# EAGLE design UartSBee v5.0 (EAGLE 6.4)
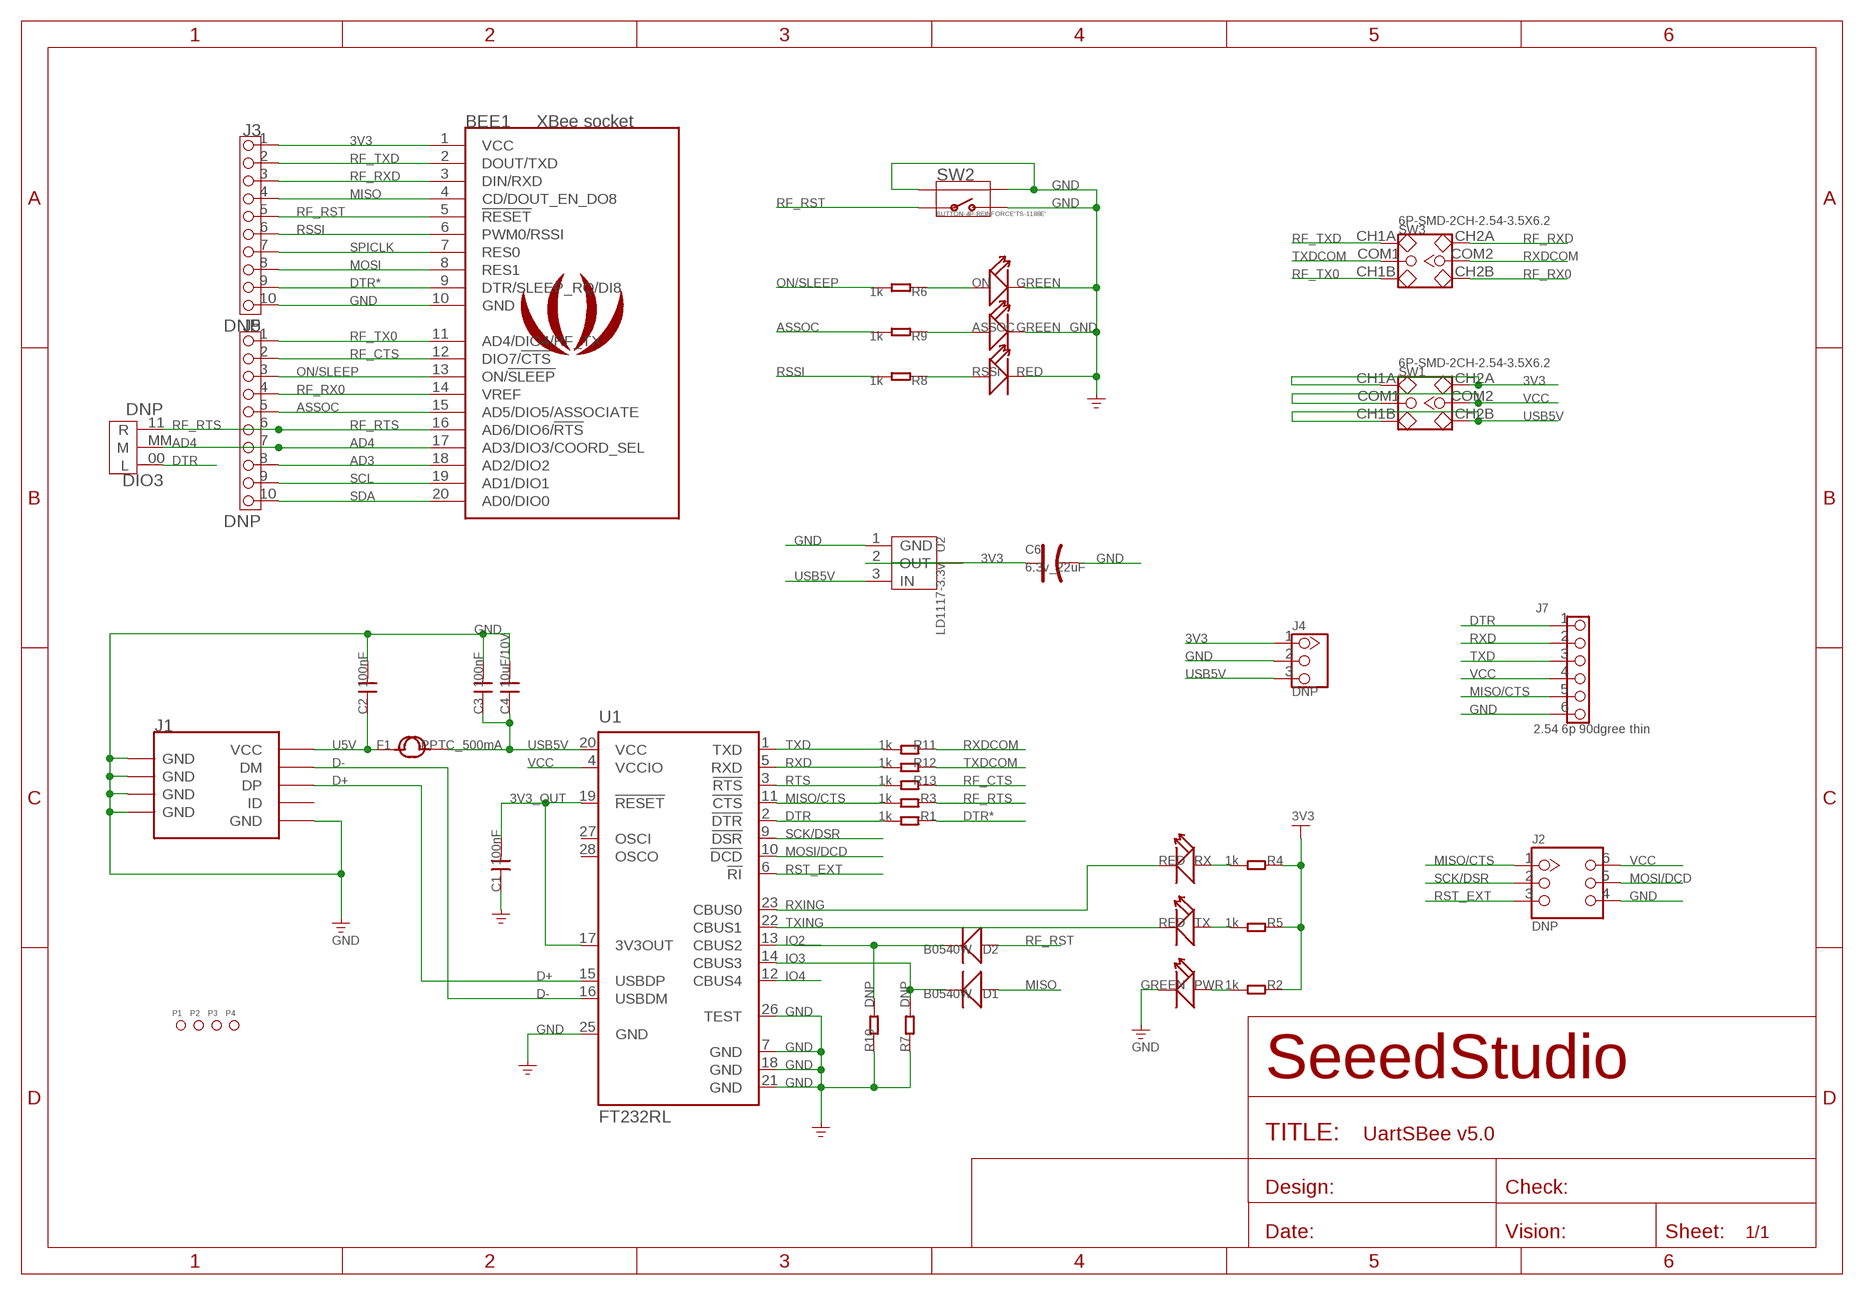
[diagram p0: schematic, sheet 1]

## Parts
ASSOC  GREEN  LED-0603  [D0603]
BEE1  XBee socket  BEE_BLANK  [BEE_BLANK]
C1  100nF  C-0603  [0603]
C2  100nF  C-0603  [0603]
C3  100nF  C-0603  [0603]
C4  10uF/10V  C-0805  [0805]
C6  6.3v_22uF  CAP_AVX_A  [AVX-A]
D1  B0540W  D'MBR0520LT1'  [SOD123-2.7X1.6]
D2  B0540W  D'MBR0520LT1'  [SOD123-2.7X1.6]
DIO3  DNP  PAD-JUMPER-3P-40*40  [3P-SMD-4.1X1.5]
F1  PPTC_500mA  FUSE'1206'  [F1206]
J1  USB-MINIUSB-5P-MICRO  [MICRO-USB]
J2  DNP  CK_2X3_DD  [CK_2X3]
J3  DNP  HEADER-10P-2.54  [10P-2.54-LEADED]
J4  DNP  HEADER-3P-2.54  [3P-2.54-LEADED]
J5  DNP  HEADER-10P-2.54  [10P-2.54-LEADED]
J7  2.54 6p 90dgree thin  HEADER-6P-LEADED-2.54  [6P-2.54-LEADED]
LOGO1  LOGO_COPPER150X124  [LOGO_COPPER_150X124]
ON  GREEN  LED-0603  [D0603]
P1  PAD-MARK  [ROUND-MARK-1.0]
P2  PAD-MARK  [ROUND-MARK-1.0]
P3  PAD-MARK  [ROUND-MARK-1.0]
P4  PAD-MARK  [ROUND-MARK-1.0]
PWR  GREEN  LED-0603  [D0603]
R1  1k  R-0603  [R0603]
R2  1k  R-0603  [R0603]
R3  1k  R-0603  [R0603]
R4  1k  R-0603  [R0603]
R5  1k  R-0603  [R0603]
R6  1k  R-0603  [R0603]
R7  DNP  R-0603  [R0603]
R8  1k  R-0603  [R0603]
R9  1k  R-0603  [R0603]
R10  DNP  R-0603  [R0603]
R11  1k  R-0603  [R0603]
R12  1k  R-0603  [R0603]
R13  1k  R-0603  [R0603]
RSSI  RED  LED-0603  [D0603]
RX  RED  LED-0603  [D0603]
SW1  6P-SMD-2CH-2.54-3.5X6.2  SWITCH-2CH-6P-SMD  [6P-SMD-2CH-2.54-3.5X6.2]
SW2  BUTTON-4P-REINFORCE'TS-1188E'  [4P-SMD-7X3.5X3.5H]
SW3  6P-SMD-2CH-2.54-3.5X6.2  SWITCH-2CH-6P-SMD  [6P-SMD-2CH-2.54-3.5X6.2]
TX  RED  LED-0603  [D0603]
U1  FT232RL  [SSOP28]
U2  LD1117-3.3v  LD1117SOT89  [SOT89]

## Nets
3V3: BEE1.1(VCC) C6.+ J3.1 J4.1 R2.1 R4.1 R5.1 SW1.CH1A SW1.CH2A U2.2(OUT) U2.4(TAB) ; supply symbol labelled POWER_BAR
3V3_OUT: C1.2 U1.17(3V3OUT) U1.19(!RESET)
AD3: BEE1.18(AD2/DIO2) J5.8
AD4: BEE1.17(AD3/DIO3/COORD_SEL) DIO3.MM(M) J5.7
ASSOC: BEE1.15(AD5/DIO5/ASSOCIATE) J5.5 R9.2
D+: J1.3(DP) U1.15(USBDP)
D-: J1.2(DM) U1.16(USBDM)
DTR: DIO3.00(L) J7.1 R1.2 U1.2(!DTR)
DTR*: BEE1.9(DTR/SLEEP_RQ/DI8) J3.9 R1.1
GND: ASSOC.- BEE1.10(GND) C1.1 C2.2 C3.2 C4.2 C6.- J1.5(GND) J1.S1(GND) J1.S2(GND) J1.S3(GND) J1.S4(GND) J1.S5(GND) J1.S6(GND) J2.4 J3.10 J4.2 J7.6 ON.- PWR.- R7.1 R10.1 RSSI.- SW2.2 SW2.S1 SW2.S2 U1.7(GND) U1.18(GND) U1.21(GND) U1.25(GND) U1.26(TEST) U2.1(GND)
IO2: D2.2(-) R10.2 U1.13(CBUS2)
IO3: D1.2(-) R7.2 U1.14(CBUS3)
IO4: U1.12(CBUS4)
MISO: BEE1.4(CD/DOUT_EN_DO8) D1.1(+) J3.4
MISO/CTS: J2.1 J7.5 R3.2 U1.11(!CTS)
MOSI: BEE1.8(RES1) J3.8
MOSI/DCD: J2.5 U1.10(!DCD)
N$1: R5.2 TX.+
N$2: R4.2 RX.+
N$3: PWR.+ R2.2
N$7: ON.+ R6.1
N$8: ASSOC.+ R9.1
N$11: R8.1 RSSI.+
ON/SLEEP: BEE1.13(ON/!SLEEP) J5.3 R6.2
RF_CTS: BEE1.12(DIO7/!CTS) J5.2 R13.1
RF_RST: BEE1.5(!RESET) D2.1(+) J3.5 SW2.1
RF_RTS: BEE1.16(AD6/DIO6/!RTS) DIO3.11(R) J5.6 R3.1
RF_RX0: BEE1.14(VREF) J5.4 SW3.CH2B
RF_RXD: BEE1.3(DIN/RXD) J3.3 SW3.CH2A
RF_TX0: BEE1.11(AD4/DIO4/RF_TX) J5.1 SW3.CH1B
RF_TXD: BEE1.2(DOUT/TXD) J3.2 SW3.CH1A
RSSI: BEE1.6(PWM0/RSSI) J3.6 R8.2
RST_EXT: J2.3 U1.6(!RI)
RTS: R13.2 U1.3(!RTS)
RXD: J7.2 R12.2 U1.5(RXD)
RXDCOM: R11.1 SW3.COM2
RXING: RX.- U1.23(CBUS0)
SCK/DSR: J2.2 U1.9(!DSR)
SCL: BEE1.19(AD1/DIO1) J5.9
SDA: BEE1.20(AD0/DIO0) J5.10
SPICLK: BEE1.7(RES0) J3.7
TXD: J7.3 R11.2 U1.1(TXD)
TXDCOM: R12.1 SW3.COM1
TXING: TX.- U1.22(CBUS1)
U5V: C2.1 F1.1 J1.1(VCC)
USB5V: C3.1 C4.1 F1.2 J4.3 SW1.CH1B SW1.CH2B U1.20(VCC) U2.3(IN)
VCC: J2.6 J7.4 SW1.COM1 SW1.COM2 U1.4(VCCIO)
Unconnected: J1.4(ID) U1.27(OSCI) U1.28(OSCO)

## Library data of the parts
ASSOC ON PWR RSSI RX TX = Discrete:LED*
BEE1 = EXT_moudle:BEE
C1-C4 = Discrete:C*: Ceramic Capacitors
C6 = Discrete:CAP*: Electrolytic Capacitors,Tantalum Capacitors and Super Capacitors
D1 D2 = Discrete:D*
DIO3 = Discrete:PAD-JUMPER-3P
F1 = Discrete:FUSE
J1 = Connector :USB-MINIUSB-5P
J2 = CONNECTER:CK_2X3
J3 J5 = Connector:HEADER-10P
J4 = Connector:HEADER-3P
J7 = Connector:HEADER-6P
LOGO1 = logo:LOGO_COPPER
P1-P4 = Discrete:PAD-MARK; PARTNO: DNP
R1-R13 = Discrete:R*
SW1 SW3 = Discrete:SWITCH-2CH-6P
SW2 = Discrete:BUTTON-4P-REINFORCE: TS-1188E http://www.best-dz.com/?thread-374-2.html
U1 = IC_SMD:FT232R: Source: http://www.ftdichip.com/Documents/DataSheets/DS_FT232R_v104.pdf
U2 = IC:LD1117

## Net classes
0 default: width 0.152 mm, drill 0.305 mm, clearance 0.152 mm

## Board
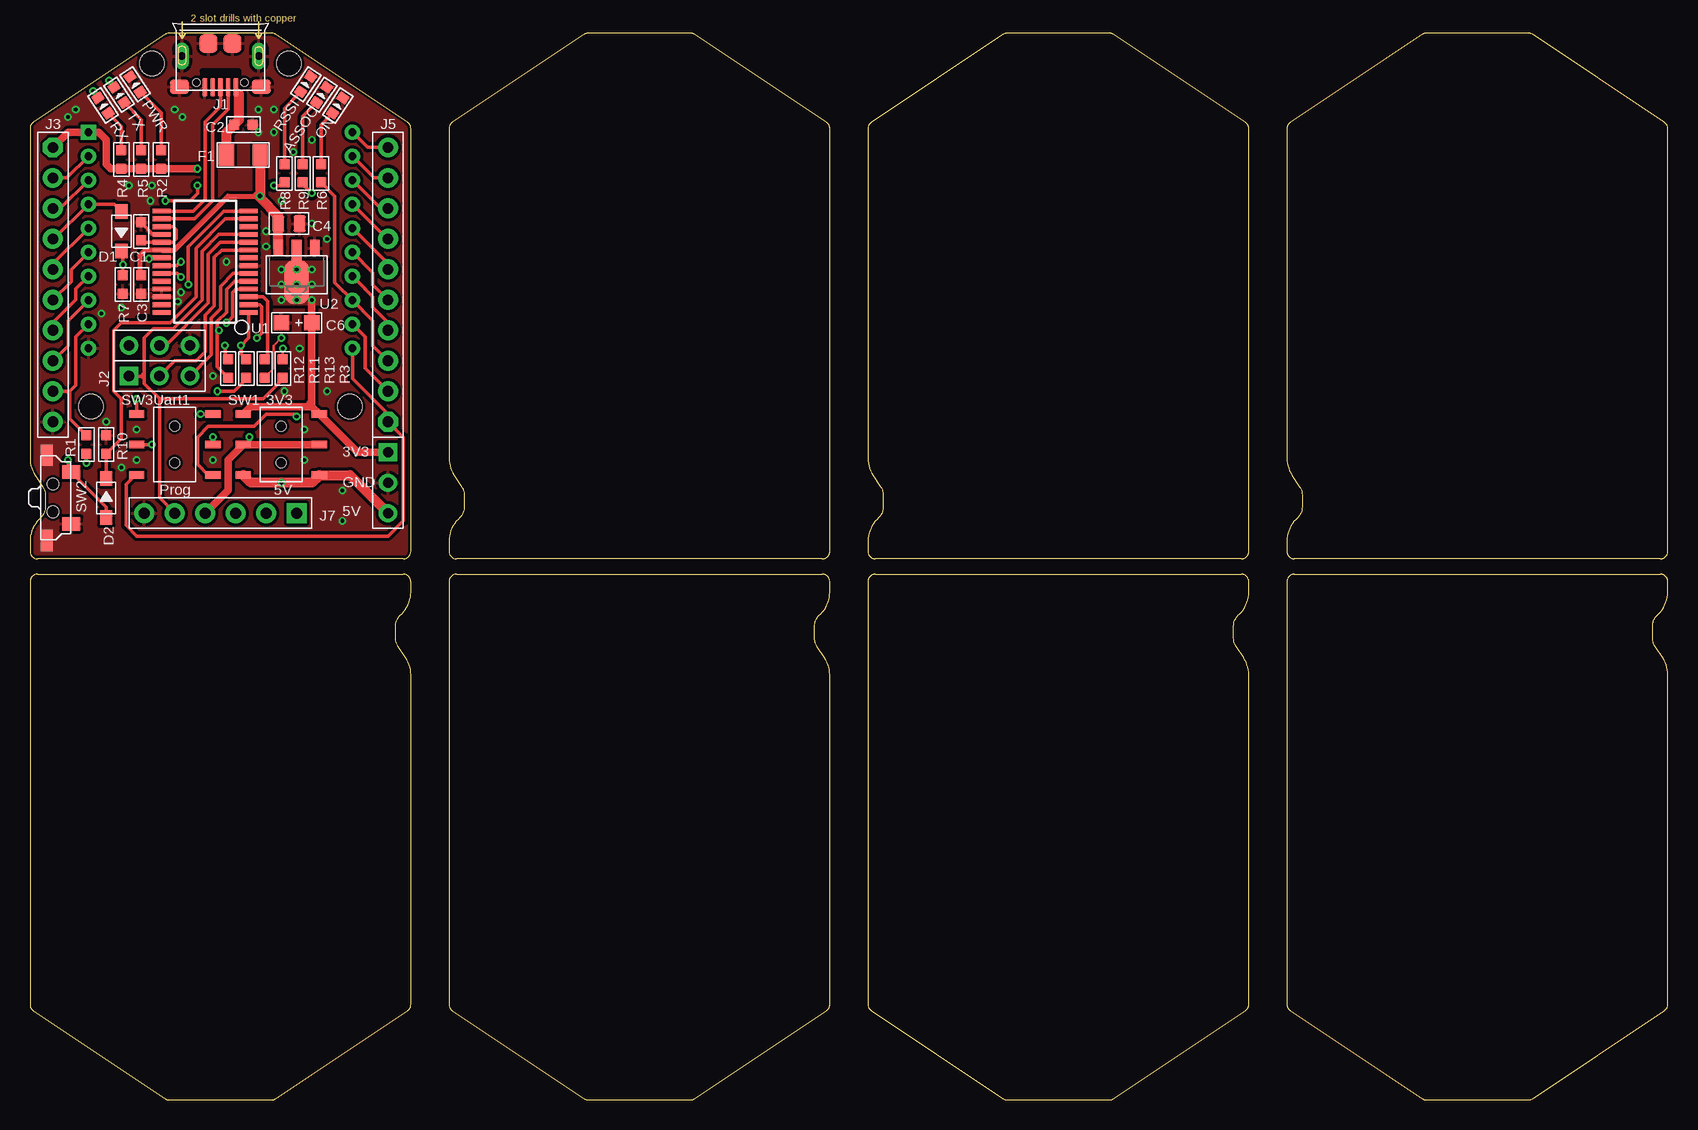
[diagram p1: board, top side]
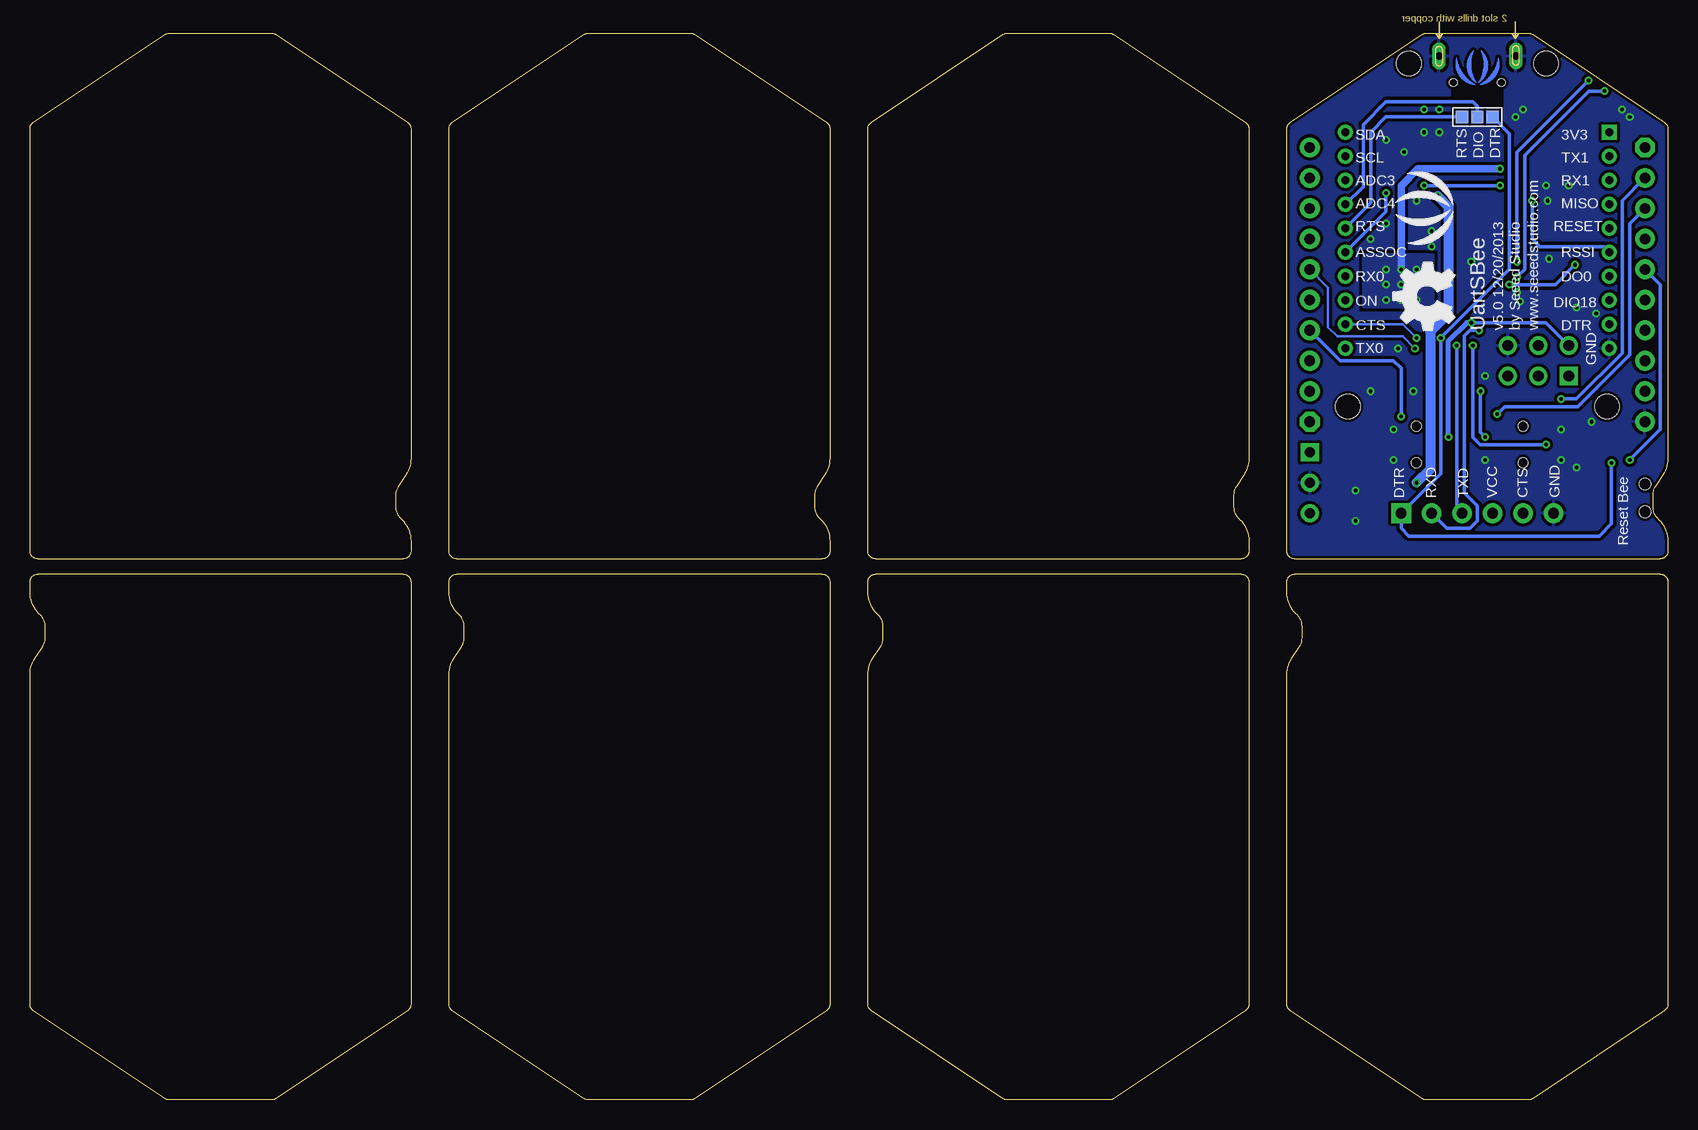
[diagram p2: board, bottom side, seen from below]

Size 136.53 x 88.9 mm. Coordinates in mm from the lower left corner, seen from the top.
Outline: 31.11,45.09 arc90 31.75,45.72 31.75,80.94 arc56 31.47,81.47 20.48,88.79 arc34 20.13,88.9 11.62,88.9 arc34 11.27,88.79 0.28,81.47 arc56 0,80.94 0,53.47 arc34 0.43,52.06 1.06,51.12 arc-34 1.27,50.41 1.27,49.42 arc-45 0.9,48.52 0.74,48.37 arc45 0,46.57 0,45.72 arc90 0.64,45.09 31.11,45.09
Outline: 0.64,43.81 arc90 0,43.18 0,7.96 arc56 0.28,7.43 11.27,0.11 arc34 11.62,0 20.13,0 arc34 20.48,0.11 31.47,7.43 arc56 31.75,7.96 31.75,35.43 arc34 31.32,36.84 30.69,37.78 arc-34 30.48,38.48 30.48,39.48 arc-45 30.85,40.38 31.01,40.53 arc45 31.75,42.33 31.75,43.18 arc90 31.11,43.81 0.64,43.81
Outline: 66.04,45.09 arc90 66.67,45.72 66.67,80.94 arc56 66.39,81.47 55.41,88.79 arc34 55.05,88.9 46.55,88.9 arc34 46.2,88.79 35.21,81.47 arc56 34.92,80.94 34.92,53.47 arc34 35.35,52.06 35.98,51.12 arc-34 36.2,50.41 36.2,49.42 arc-45 35.82,48.52 35.67,48.37 arc45 34.92,46.57 34.92,45.72 arc90 35.56,45.09 66.04,45.09
Outline: 35.56,43.81 arc90 34.92,43.18 34.92,7.96 arc56 35.21,7.43 46.2,0.11 arc34 46.55,0 55.05,0 arc34 55.41,0.11 66.39,7.43 arc56 66.67,7.96 66.67,35.43 arc34 66.25,36.84 65.62,37.78 arc-34 65.41,38.48 65.41,39.48 arc-45 65.78,40.38 65.93,40.53 arc45 66.67,42.33 66.67,43.18 arc90 66.04,43.81 35.56,43.81
Outline: 100.97,45.09 arc90 101.6,45.72 101.6,80.94 arc56 101.32,81.47 90.33,88.79 arc34 89.98,88.9 81.47,88.9 arc34 81.12,88.79 70.13,81.47 arc56 69.85,80.94 69.85,53.47 arc34 70.28,52.06 70.91,51.12 arc-34 71.12,50.41 71.12,49.42 arc-45 70.75,48.52 70.59,48.37 arc45 69.85,46.57 69.85,45.72 arc90 70.48,45.09 100.97,45.09
Outline: 70.48,43.81 arc90 69.85,43.18 69.85,7.96 arc56 70.13,7.43 81.12,0.11 arc34 81.47,0 89.98,0 arc34 90.33,0.11 101.32,7.43 arc56 101.6,7.96 101.6,35.43 arc34 101.17,36.84 100.54,37.78 arc-34 100.33,38.48 100.33,39.48 arc-45 100.7,40.38 100.86,40.53 arc45 101.6,42.33 101.6,43.18 arc90 100.97,43.81 70.48,43.81
Outline: 135.89,45.09 arc90 136.53,45.72 136.53,80.94 arc56 136.24,81.47 125.25,88.79 arc34 124.9,88.9 116.4,88.9 arc34 116.05,88.79 105.06,81.47 arc56 104.78,80.94 104.78,53.47 arc34 105.2,52.06 105.83,51.12 arc-34 106.05,50.41 106.05,49.42 arc-45 105.67,48.52 105.52,48.37 arc45 104.78,46.57 104.78,45.72 arc90 105.41,45.09 135.89,45.09
Outline: 105.41,43.81 arc90 104.78,43.18 104.78,7.96 arc56 105.06,7.43 116.05,0.11 arc34 116.4,0 124.9,0 arc34 125.25,0.11 136.24,7.43 arc56 136.53,7.96 136.53,35.43 arc34 136.1,36.84 135.47,37.78 arc-34 135.25,38.48 135.25,39.48 arc-45 135.63,40.38 135.78,40.53 arc45 136.53,42.33 136.53,43.18 arc90 135.89,43.81 105.41,43.81
Copper layers (1*16): Top 0.035mm / dielectric 1.5mm / Bottom 0.035mm
Design rules "SeeedStudio_DRU_no_angle_20130527 *": minimum track width 6mil, minimum drill 12mil, track to track 6mil, track to pad 6mil, pad to pad 6mil, via to via 6mil, smd to smd 0mil, copper to edge 10mil, drill to drill 10mil, minimum pad ring 10mil, minimum via ring 6mil, stop-mask expansion 2mil, vias tented up to drill 25mil, thermal gap 10mil
Holes 2.03 mm at 10.16,86.36 21.59,86.36 5.08,57.78 26.67,57.78
Holes 1.91 mm at -4.06,81.28 -4.06,8.89 140.59,8.89 140.59,81.28
tRestrict: area 9,64.2 to 10.4,65.2
bRestrict: area 14,81.9 to 17.8,85.1

### Footprints (pad centres in the part's own frame; a part is rotated, then mirrored left to right if it is on the bottom)
D0603 = smd 0.762 x 0.889: + -0.762,0; - 0.762,0
BEE_BLANK = drill 0.635 pad 1.27 square: 1 -11,0 | drill 0.635 pad 1.27: 2 -11,-2; 3 -11,-4; 4 -11,-6; 5 -11,-8; 6 -11,-10; 7 -11,-12; 8 -11,-14; 9 -11,-16; 10 -11,-18; 11 11,-18; 12 11,-16; 13 11,-14; 14 11,-12; 15 11,-10; 16 11,-8; 17 11,-6; 18 11,-4; 19 11,-2; 20 11,0
0603 = smd 0.889 x 0.889: 1 -0.762,0; 2 0.762,0
0805 = smd 1.016 x 1.397: 1 -0.889,0; 2 0.889,0
AVX-A = smd 1.27 x 1.27: + -1.27,0; - 1.27,0
SOD123-2.7X1.6 = smd 1.2 x 1.02: 1 -1.635,0; 2 1.635,0
3P-SMD-4.1X1.5 = smd 1.016 x 1.016: 00 -1.27,0; 11 1.27,0; MM 0,0
F1206 = smd 1.27 x 1.778: 1 -1.397,0; 2 1.397,0
MICRO-USB = smd 0.381 x 1.524: 1 -1.3,-0.25; 2 -0.65,-0.25; 3 0,-0.25; 4 0.65,-0.25; 5 1.3,-0.25 | smd 1.6 x 1.2: S1 -3.4,-0.3; S6 3.4,-0.3 | drill 0.635 pad 1.143 long: S2 -3.2,-2.85; S5 3.2,-2.85 | smd 1.5 x 1.5: S3 -1,-3.9; S4 1,-3.9 | hole 0.635: -2,-0.65; 2,-0.65
CK_2X3 = drill 0.889 pad 1.524 square: 1 -1.27,2.54 | drill 0.889 pad 1.524: 2 -1.27,0; 3 -1.27,-2.54; 4 1.27,-2.54; 5 1.27,0; 6 1.27,2.54
10P-2.54-LEADED = drill 0.889 pad 1.651 octagon: 1 0,11.43 | drill 0.889 pad 1.651: 2 0,8.89; 3 0,6.35; 4 0,3.81; 5 0,1.27; 6 0,-1.27; 7 0,-3.81; 8 0,-6.35; 9 0,-8.89; 10 0,-11.43
3P-2.54-LEADED = drill 0.813 pad 1.524 square: 1 0,2.54 | drill 0.813 pad 1.524: 2 0,0; 3 0,-2.54
6P-2.54-LEADED = drill 0.889 pad 1.651 square: 1 0,6.35 | drill 0.889 pad 1.651: 2 0,3.81; 3 0,1.27; 4 0,-1.27; 5 0,-3.81; 6 0,-6.35
ROUND-MARK-1.0 = smd 1.016 x 1.016: P$1 0,0
R0603 = smd 0.889 x 0.889: 1 -0.762,0; 2 0.762,0
6P-SMD-2CH-2.54-3.5X6.2 = smd 1.27 x 0.635: CH1A -3.175,2.54; CH1B -3.175,-2.54; CH2A 3.175,2.54; CH2B 3.175,-2.54; COM1 -3.175,0; COM2 3.175,0 | hole 0.813: 0,1.524; 0,-1.524
4P-SMD-7X3.5X3.5H = smd 1.143 x 1.524: 1 -2.159,1.524; 2 2.159,1.524 | smd 1.778 x 1.016: S1 -3.556,-0.508; S2 3.556,-0.508 | hole 0.95: -1.15,0; 1.15,0
SSOP28 = smd 0.4 x 1.5: 1 -4.225,-3.625; 2 -3.575,-3.625; 3 -2.925,-3.625; 4 -2.275,-3.625; 5 -1.625,-3.625; 6 -0.975,-3.625; 7 -0.325,-3.625; 8 0.325,-3.625; 9 0.975,-3.625; 10 1.625,-3.625; 11 2.275,-3.625; 12 2.925,-3.625; 13 3.575,-3.625; 14 4.225,-3.625; 15 4.225,3.625; 16 3.575,3.625; 17 2.925,3.625; 18 2.275,3.625; 19 1.625,3.625; 20 0.975,3.625; 21 0.325,3.625; 22 -0.325,3.625; 23 -0.975,3.625; 24 -1.625,3.625; 25 -2.275,3.625; 26 -2.925,3.625; 27 -3.575,3.625; 28 -4.225,3.625
SOT89 = smd 0.8 x 1.4: 1 -1.524,-1.905; 3 1.524,-1.905 | smd 0.8 x 1.9: 2 0,-1.651 | smd 2.032 x 3.65: 4 0,0.94

### Placement (x,y rotation side)
ASSOC  24.32,83.76 56.4 top
BEE1  15.88,80.65 0 top
C1  9.27,72.39 270 top
C2  17.78,81.28 0 top
C3  9.27,67.94 270 top
C4  21.59,73.03 0 top
C6  22.23,64.77 180 top
D1  7.62,72.39 270 top
D2  6.35,50.16 90 top
DIO3  15.88,81.91 180 bottom
F1  17.78,78.74 0 top
J1  15.88,84.14 180 top
J2  10.79,61.59 90 top
J3  1.91,67.94 0 top
J4  29.84,51.44 0 top
J5  29.84,67.94 180 top
J7  15.88,48.9 270 top
LOGO1  15.88,85.72 0 bottom
ON  25.65,82.87 56.4 top
P1  -4.06,86.36 0 top  (outside the outline)
P2  -4.06,3.81 0 top  (outside the outline)
P3  140.59,3.81 0 top  (outside the outline)
P4  140.59,86.36 0 top  (outside the outline)
PWR  8.76,84.63 123.6 top
R1  4.7,54.61 270 top
R2  10.92,78.36 90 top
R3  21.08,60.96 270 top
R4  7.62,78.36 90 top
R5  9.27,78.36 90 top
R6  24.26,77.22 270 top
R7  7.75,67.94 90 top
R8  21.21,77.22 270 top
R9  22.73,77.22 270 top
R10  6.35,54.61 270 top
R11  18.03,60.96 90 top
R12  16.51,60.96 270 top
R13  19.56,60.96 90 top
RSSI  22.99,84.65 56.4 top
RX  6.1,82.87 123.6 top
SW1  20.95,54.61 0 top
SW2  1.91,50.16 270 top
SW3  12.06,54.61 0 top
TX  7.43,83.76 123.6 top
U1  14.61,69.85 90 top
U2  22.23,69.09 180 top
U$1  [OSHW_FILLX200_NOTEXT]  17.78,64.14 90 bottom
U$2  [LOGO_SILK]  19.56,74.3 90 bottom

### Tracks (layer width: path | path; a pad name or v marks a point on that pad's centre or on a via)
3V3  (via drill 0.3 pad 0.64)
  Top 0.61: J3.1 3.17,80.65 BEE1.1 5.71,80.65 6.35,80.01 6.35,77.98 6.73,77.6 R4.1 R5.1 R2.1 v13.97,77.6 | J4.1 27.3,53.98 SW1.CH2A 23.5,57.78 | SW1.CH1A 18.41,57.78 23.11,57.78 | 23.11,57.78 23.5,57.78 | 23.5,58.17 C6.+ v23.5,66.67 | 23.5,58.17 23.5,57.78 | 23.11,57.78 23.5,58.17 | v22.23,69.22 U2.2
  Bottom 0.61: v13.97,77.6 20.83,77.6 22.23,76.2 v22.23,69.22
  other vias: 20.95,69.22 23.5,69.22 23.5,67.94 22.23,67.94 20.95,67.94 20.95,66.67 22.23,66.67
  pour Top (isolate 0.254, no thermals): 20.19,69.85 24.77,69.85 24.77,66.29 20.19,66.29
  pour Bottom (isolate 0.254, no thermals): 19.56,70.48 25.4,70.48 25.4,66.04 19.56,66.04
3V3_OUT
  Top 0.305: U1.17 11.93,72.78 12.19,72.52 12.19,71.75 11.91,71.47 U1.19 9.42,71.47 C1.2
AD3
  Top 0.305: J5.8 29.23,74.3 BEE1.18
AD4
  Top 0.305: J5.7 29.77,71.75 BEE1.17
  Bottom 0.305: DIO3.MM 15.88,82.8 16.26,83.19 23.5,83.19 25.4,81.28 25.4,76.12 BEE1.17
ASSOC  (via drill 0.3 pad 0.64)
  Top 0.305: J5.5 28.57,67.94 28.57,68.94 BEE1.15 | R9.2 22.73,76.33 v23.5,75.56
  Bottom 0.305: BEE1.15 23.5,74.03 v23.5,75.56
D+
  Top 0.305: J1.3 15.88,82.8 14.61,81.53 14.61,75.06 13.62,74.08 U1.15
D-
  Top 0.305: J1.2 16.52,82.56 15.24,81.28 15.24,74.93 13.73,73.42 U1.16
DTR  (via drill 0.3 pad 0.64)
  Top 0.305: U1.2 19.14,66.28 19.3,66.11 19.3,63.88 v18.92,63.5 | R1.2 v4.7,53.09
  Bottom 0.305: v4.7,53.09 4.7,48.01 5.71,46.99 21.59,46.99 22.23,47.62 J7.1 18.92,52.2 v18.92,63.5 13.21,69.22 13.21,80.52 DIO3.00
DTR*
  Top 0.305: BEE1.9 3.81,63.58 3.81,59.56 3.3,59.05 | R1.1 3.3,56.77 3.3,58.8 | 3.3,58.8 3.3,59.05 | J3.9 3.05,59.05 | 3.05,59.05 3.3,59.05 | 3.05,59.05 3.3,58.8
GND  (via drill 0.3 pad 0.64)
  Top 0.305: U1.18 10.23,72.12 9.27,73.09 C1.1
  Top 0.406: U1.21 9.98,70.17 v9.91,70.1
  other vias: 16.38,69.85 22.48,62.61 21.21,59.05 19.68,72.39 19.68,71.12 20.95,74.93 19.05,82.55 20.32,82.55 5.97,65.53 7.62,66.04 12.57,67.31 12.32,66.55 10.03,74.93 8.26,76.2 20.32,80.65 12.7,81.91 12.06,82.55 8.89,55.88 7.62,52.7 8.89,53.34 15.24,53.34 22.86,55.88 22.86,53.34 24.77,59.05 26.04,50.8 26.04,48.26 10.16,76.2 24.77,71.75 23.5,80.01 21.97,78.99 6.35,56.52 23.5,73.03 15.24,60.33 3.81,82.55 3.17,81.91 19.05,80.65
  pour Top (isolate 0.254, rank 6): 0,88.9 31.75,88.9 31.75,45.09 0,45.09
  pour Bottom (isolate 0.254, rank 6): 0,88.9 31.75,88.9 31.75,45.09 0,45.09
IO2
  Top 0.305: D2.2 R10.2 7.62,55.12 7.62,58.42 6.99,59.05 6.99,64.14 7.62,64.77 11.68,64.77 13.84,66.93 13.84,70.99 16.27,73.42 U1.13
IO3  (via drill 0.3 pad 0.64)
  Top 0.305: U1.14 16.16,74.08 13.21,71.12 v13.21,67.94 | R7.2 v7.75,69.6 7.75,70.63 D1.2
  Top 0.406: 7.37,70.88 7.73,70.88 7.75,70.87 7.62,70.74 D1.2
  Bottom 0.305: v13.21,67.94 9.4,67.94 v7.75,69.6
MISO
  Top 0.305: J3.4 1.99,71.75 BEE1.4 7,74.64 D1.1
MISO/CTS
  Top 0.305: U1.11 15.74,72.12 14.35,70.74 14.35,66.67 11.94,64.26 10.29,64.26 9.53,63.5 9.53,60.58 | J7.5 10.79,50.16 10.79,58.42 | 9.53,60.33 9.53,60.07 | 9.53,60.07 9.53,59.69 10.79,58.42 | J2.1 9.27,60.33 | 9.27,60.33 9.53,60.33 | 9.27,60.33 9.53,60.58 | 9.27,60.33 9.53,60.07 | 9.53,60.33 9.53,60.58 | R3.2 21.08,60.07 19.43,58.42 10.79,58.42
MOSI
  Top 0.305: J3.8 3.17,62.87 3.17,64.94 BEE1.8
MOSI/DCD
  Top 0.305: U1.10 15.85,71.47 14.86,70.48 14.86,66.42 11.3,62.87 J2.5
N$1
  Top 0.305: R5.2 9.27,81.7 TX.+
N$2
  Top 0.305: R4.2 7.62,81.13 RX.+
N$3
  Top 0.305: R2.2 10.92,82.26 PWR.+
N$7
  Top 0.305: 24.77,81.77 ON.+ 24.26,81.26 R6.1
N$8
  Top 0.305: ASSOC.+ 22.73,81.96 R9.1
N$11
  Top 0.305: RSSI.+ 21.21,82.65 R8.1
ON/SLEEP
  Top 0.305: J5.3 28.57,62.87 28.57,64.94 BEE1.13 25.4,68.12 25.4,75.31 R6.2
RF_CTS  (via drill 0.3 pad 0.64)
  Top 0.203: R13.1 20.32,60.96 20.32,62.87 v20.95,63.5
  Top 0.305: J5.2 27.94,60.96 27.94,63.58 BEE1.12
  Bottom 0.203: BEE1.12 22.1,64.64 v20.95,63.5
RF_RST  (via drill 0.3 pad 0.64)
  Top 0.305: J3.5 1.91,69.67 BEE1.5 | D2.1 6.35,49.4 SW2.1 3.17,52.58 v3.17,53.34
  Bottom 0.305: J3.5 0.64,67.94 0.64,55.88 v3.17,53.34
RF_RTS  (via drill 0.3 pad 0.64)
  Top 0.203: R3.1 v21.08,62.61
  Top 0.305: J5.6 29.84,69.67 BEE1.16
  Bottom 0.203: J5.6 28.32,67.69 28.32,64.39 27.56,63.63 22.1,63.63 v21.08,62.61
  Bottom 0.305: DIO3.11 23.5,81.91 24.77,80.65 24.77,74.75 BEE1.16
RF_RX0  (via drill 0.3 pad 0.64)
  Top 0.305: BEE1.14 27.94,67.58 27.94,67.56 28.57,66.93 28.57,66.04 29.84,64.77 J5.4 | SW3.CH2B 14.86,52.07 13.97,52.96 13.97,55.25 14.86,56.13 18.67,56.13 19.68,57.15 22.04,57.15 v22.23,56.96
  Bottom 0.305: J5.4 27.3,61.59 22.86,61.59 22.23,60.96 v22.23,56.96
RF_RXD  (via drill 0.3 pad 0.64)
  Top 0.305: J3.3 2.52,74.3 BEE1.3 | v14.22,57.15 SW3.CH2A
  Bottom 0.305: J3.3 3.17,73.03 3.17,62.1 7.49,57.78 13.59,57.78 v14.22,57.15
RF_TX0
  Top 0.305: BEE1.11 26.88,60.12 29.84,57.15 J5.1 31.11,55.25 31.11,48.26 29.84,46.99 8.89,46.99 8,47.88 8,51.31 8.76,52.07 SW3.CH1B
RF_TXD  (via drill 0.3 pad 0.64)
  Top 0.305: J3.2 3.06,76.84 BEE1.2 | v8.89,58.42 SW3.CH1A
  Bottom 0.305: J3.2 3.81,74.93 3.81,62.23 7.62,58.42 v8.89,58.42
RSSI  (via drill 0.3 pad 0.64)
  Top 0.305: J3.6 3.43,68.2 3.43,69.2 BEE1.6 | v20.32,76.2 21.21,76.2 R8.2 | v11.3,74.93 13.34,74.93 13.97,75.56 v13.97,76.2
  Bottom 0.305: v13.97,76.2 v20.32,76.2 | v11.3,74.93 11.3,71.75 10.67,71.12 5.33,71.12 4.88,70.66 BEE1.6
RST_EXT
  Top 0.305: U1.6 16.93,68.88 15.88,67.82 15.88,65.91 15.11,65.15 15.11,62.1 J2.3
RTS
  Top 0.305: U1.3 19.43,66.92 19.81,66.55 19.81,61.98 R13.2
RXD  (via drill 0.3 pad 0.64)
  Top 0.305: U1.5 17.04,68.22 16.38,67.56 16.38,65.66 15.62,64.9 15.62,64.14 | R12.2 15.62,61.09 15.62,64.14 | v15.75,64.14 15.62,64.14
  Bottom 0.305: v15.75,64.14 16.51,64.14 16.95,63.69 16.95,50.61 15.88,49.53 15.88,48.26 16.51,47.62 18.41,47.62 J7.2
RXDCOM  (via drill 0.3 pad 0.64)
  Top 0.305: R11.1 18.03,60.07 17.02,59.05 v15.62,59.05 | v15.24,55.25 SW3.COM2
  Bottom 0.305: v15.62,59.05 15.62,55.63 v15.24,55.25
RXING  (via drill 0.3 pad 0.64)
  Top 0.305: U1.23 12.28,68.88 v12.57,68.58 | RX.- 5.67,83.67 v5.27,84.07
  Bottom 0.305: v12.57,68.58 11.94,69.22 11.94,78.74 6.6,84.07 v5.27,84.07
SCK/DSR
  Top 0.305: U1.9 15.96,70.83 15.37,70.23 15.37,66.17 14.61,65.41 14.61,62.36 13.84,61.59 12.06,61.59 J2.2
SCL
  Top 0.305: J5.9 28.68,76.84 BEE1.19
SDA
  Top 0.305: J5.10 28.14,79.38 BEE1.20
SPICLK
  Top 0.305: 4.88,68.63 BEE1.7 3.81,67.58 3.81,66.67 1.91,64.77 J3.7
TXD  (via drill 0.3 pad 0.64)
  Top 0.305: R11.2 17.59,62.16 v17.59,62.87 18.23,63.5 U1.1
  Bottom 0.305: v17.59,62.87 17.59,49.34 J7.3
TXDCOM  (via drill 0.3 pad 0.64)
  Top 0.305: v10.16,54.61 SW3.COM1 | v16.26,62.87 16.26,61.98 R12.1
  Bottom 0.305: v16.26,62.87 16.26,55.25 15.62,54.61 v10.16,54.61
TXING  (via drill 0.3 pad 0.64)
  Top 0.305: U1.22 12.25,69.53 v12.57,69.85 | TX.- 7.01,84.56 v6.6,84.96
  Bottom 0.305: v6.6,84.96 12.57,78.99 v12.57,69.85
U5V
  Top 0.203: J1.1 17.18,83.85 17.14,83.82 17.4,83.82
  Top 0.813: 17.4,83.82 17.4,81.66 C2.1 16.38,80.65 F1.1
USB5V  (via drill 0.3 pad 0.64, 0.38 pad 0.64)
  Top 0.406: 18.67,75.31 16.51,75.31 12.02,70.83 U1.20 9.61,70.83 9.14,70.36 9.14,68.83 C3.1 | 18.67,75.31 v19.18,75.31 | 18.67,75.31 19.05,75.69
  Top 0.813: J4.3 26.67,52.07 SW1.CH2B 23.5,51.44 v20.95,51.44 18.41,51.44 SW1.CH1B | U2.3 C4.1 | C4.1 20.7,73.28 | F1.2 v19.18,75.31 19.18,75.18 20.7,73.66 C4.1
  Bottom 0.813: v20.95,51.44 19.81,52.58 19.81,64.01 18.29,65.53 18.29,74.42 v19.18,75.31
VCC  (via drill 0.3 pad 0.64)
  Top 0.305: v16.38,64.77 16.89,65.28 16.89,67.31 17.16,67.58 U1.4
  Top 0.406: v18.29,55.25 18.29,54.61
  Top 0.61: SW1.COM2 18.29,54.61 SW1.COM1 16.51,53.34 16.51,50.8 J7.4
  Bottom 0.305: v16.38,64.77 10.16,64.77 J2.6
  Bottom 0.406: v18.29,55.25 18.29,63.25 16.76,64.77 v16.38,64.77

### Text on the board
tPlace: Uart1 | 3V3 | 3V3 | GND | Prog | 5V | 5V
bPlace: 3V3 | SDA | TX1 | DTR | DIO | RTS | SCL | RX1 | ADC3 | MISO | ADC4 | RESET | RTS | RSSI | ASSOC | DO0 | RX0 | DIO18 | ON | DTR | www.seeedstudio.com | by Seeed Studio | v5.0 12/20/2013 | UartSBee | CTS | TX0 | GND | GND | CTS | VCC | TXD | RXD | DTR | Reset Bee